# EAGLE design FMS (EAGLE 9.6.2)
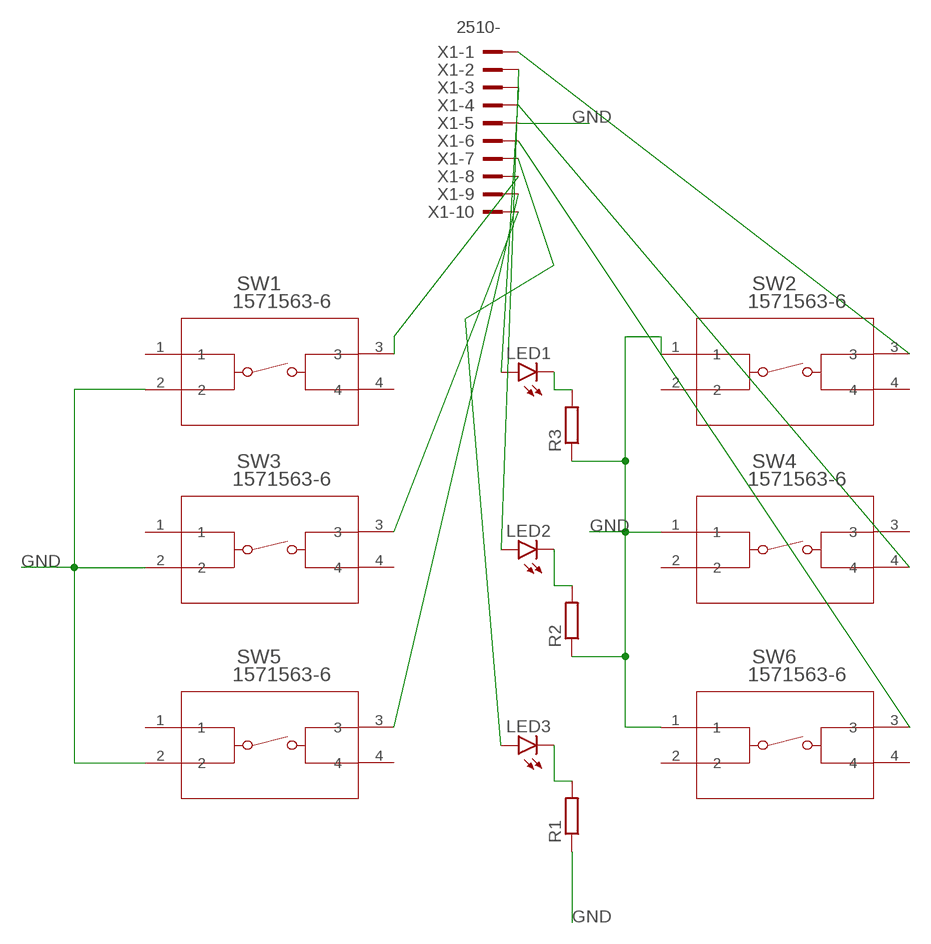
[diagram p0: schematic, sheet 1]

## Parts
LED1  LEDCHIPLED_1206  [CHIPLED_1206]
LED2  LEDCHIPLED_1206  [CHIPLED_1206]
LED3  LEDCHIPLED_1206  [CHIPLED_1206]
R1  R-EU_R1206  [R1206]
R2  R-EU_R1206  [R1206]
R3  R-EU_R1206  [R1206]
SW1  1571563-6  [SW4_1437565-E]
SW2  1571563-6  [SW4_1437565-E]
SW3  1571563-6  [SW4_1437565-E]
SW4  1571563-6  [SW4_1437565-E]
SW5  1571563-6  [SW4_1437565-E]
SW6  1571563-6  [SW4_1437565-E]
X1  2510-  [PAK100/2500-10]

## Nets
GND: R1.1 R2.1 R3.1 SW1.2 SW2.1 SW3.2 SW4.1 SW5.2 SW6.1 X1.5
N$1: LED1.A X1.3
N$2: SW2.3 X1.1
N$3: LED2.A X1.2
N$4: LED1.C R3.2
N$5: LED2.C R2.2
N$6: LED3.C R1.2
N$7: SW4.4 X1.4
N$8: SW6.3 X1.6
N$9: LED3.A X1.7
N$10: SW1.3 X1.8
N$11: SW3.3 X1.10
N$12: SW5.3 X1.9
Unconnected: SW1.1 SW1.4 SW2.2 SW2.4 SW3.1 SW3.4 SW4.2 SW4.3 SW5.1 SW5.4 SW6.2 SW6.4

## Library data of the parts
LED1-LED3 = led:LED: LED OSRAM: - CHIPLED LG R971, LG N971, LY N971, LG Q971, LY Q971, LO R971, LY R971 LH N974, LH R974 LS Q976, LO Q976, LY Q976 LO Q996 - Hyper CHIPLED LW Q18S LB Q993, LB Q99A, LB R99A - SideLED LS A670, LO A670, LY A670, LG A670, LP A670 LB A673, LV A673, LT A673, LW A673 LH A674 LY A675 LS A676, LA A676, LO A676, LY A676, LW A676 LS A679, LY A679, LG A679 - Hyper Micro SIDELED® LS Y876, LA Y876, LO Y876, LY Y876 LT Y87S - SmartLED LW L88C, LW L88S LB L89C, LB L89S, LG L890 LS L89K, LO L89K, LY L89K LS L896, LA L896, LO L896, LY L896 - TOPLED LS T670, LO T670, LY T670, LG T670, LP T670 LSG T670, LSP T670, LSY T670, LOP T670, LYG T670 LG T671, LOG T671, LSG T671 LB T673, LV T673, LT T673, LW T673 LH T674 LS T676, LA T676, LO T676, LY T676, LB T676, LH T676, LSB T676, LW T676 LB T67C, LV T67C, LT T67C, LS T67K, LO T67K, LY T67K, LW E67C LS E67B, LA E67B, LO E67B, LY E67B, LB E67C, LV E67C, LT E67C LW T67C LS T679, LY T679, LG T679 LS T770, LO T770, LY T770, LG T770, LP T770 LB T773, LV T773, LT T773, LW T773 LH T774 LS E675, LA E675, LY E675, LS T675 LS T776, LA T776, LO T776, LY T776, LB T776 LHGB T686 LT T68C, LB T68C - Hyper Mini TOPLED® LB M676 - Mini TOPLED Santana® LG M470 LS M47K, LO M47K, LY M47K Source: http://www.osram.convergy.de LUXEON: - LUMILED® LXK2-PW12-R00, LXK2-PW12-S00, LXK2-PW14-U00, LXK2-PW14-V00 LXK2-PM12-R00, LXK2-PM12-S00, LXK2-PM14-U00 LXK2-PE12-Q00, LXK2-PE12-R00, LXK2-PE12-S00, LXK2-PE14-T00, LXK2-PE14-U00 LXK2-PB12-K00, LXK2-PB12-L00, LXK2-PB12-M00, LXK2-PB14-N00, LXK2-PB14-P00, LXK2-PB14-Q00 LXK2-PR12-L00, LXK2-PR12-M00, LXK2-PR14-Q00, LXK2-PR14-R00 LXK2-PD12-Q00, LXK2-PD12-R00, LXK2-PD12-S00 LXK2-PH12-R00, LXK2-PH12-S00 LXK2-PL12-P00, LXK2-PL12-Q00, LXK2-PL12-R00 Source: www.luxeon.com KINGBRIGHT: KA-3528ASYC Source: www.kingbright.com
R1-R3 = rcl:R-EU_: RESISTOR, European symbol; SPICEPREFIX: R
SW1-SW6 = Switches:1571563-6; BUILT_BY: EMA_UL_Team; CATEGORY: Tactile Switches; COPYRIGHT: Copyright (C) 2016 Accelerated Designs. All rights reserved; DESCRIPTION: FSM14JSMAATR=TACT,SMT,T&R; MANUFACTURER_PART_NUMBER: 1571563-6; PART_STATUS: active; SERIES: Alcoswitch FSMJSMA; VENDOR: TE Connectivity
X1 = con-3m:2510-: 3M (TM) Pak 100 4-Wall Header Source: 3M; MF: 3M; MPN: 2510-6002UB; OC_FARNELL: 9838244; OC_NEWARK: 46F4725

## Board
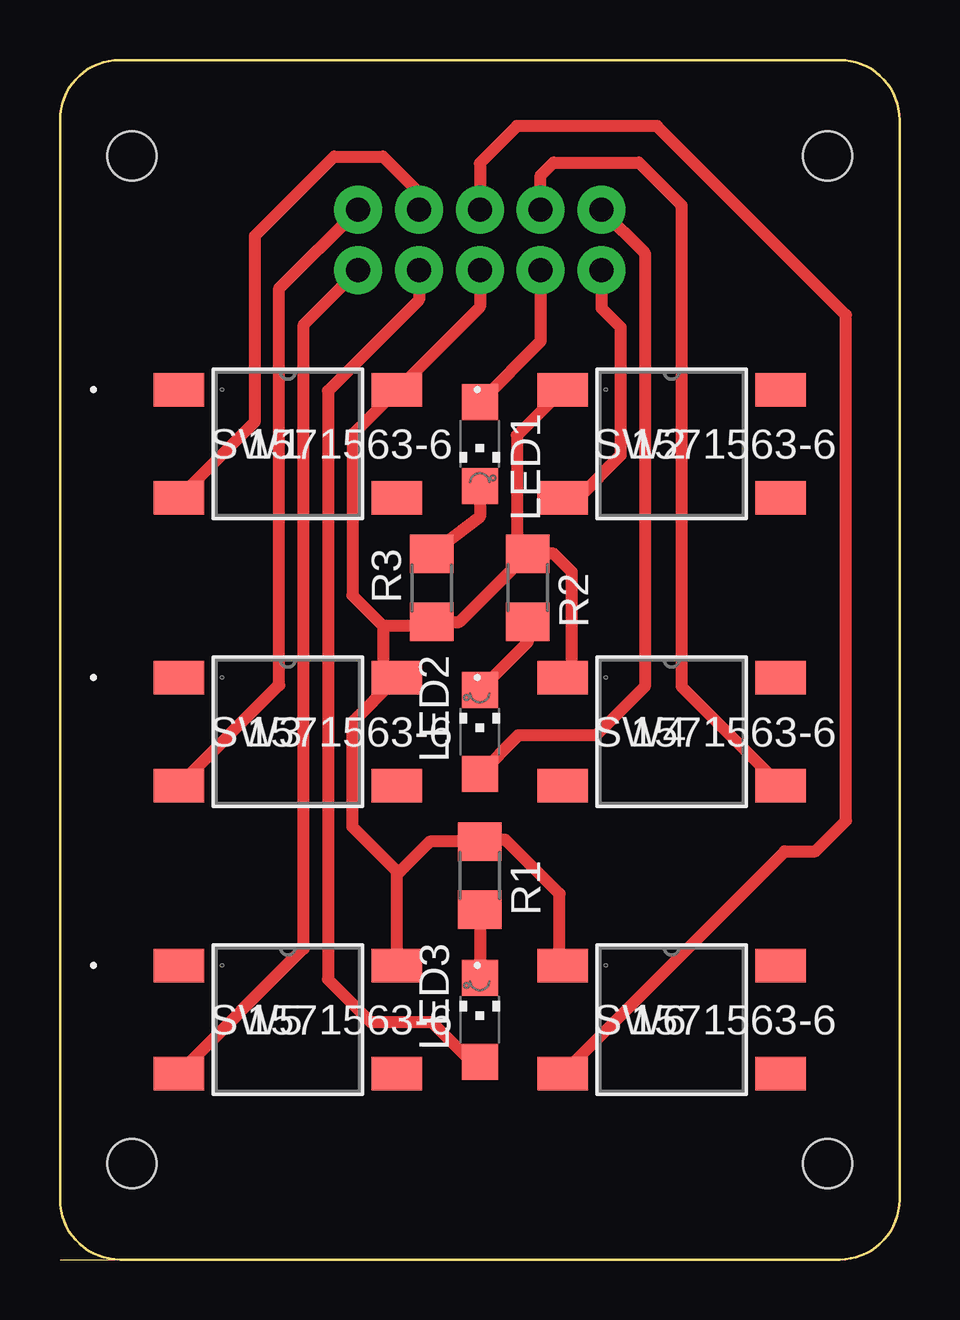
[diagram p1: board, top side]
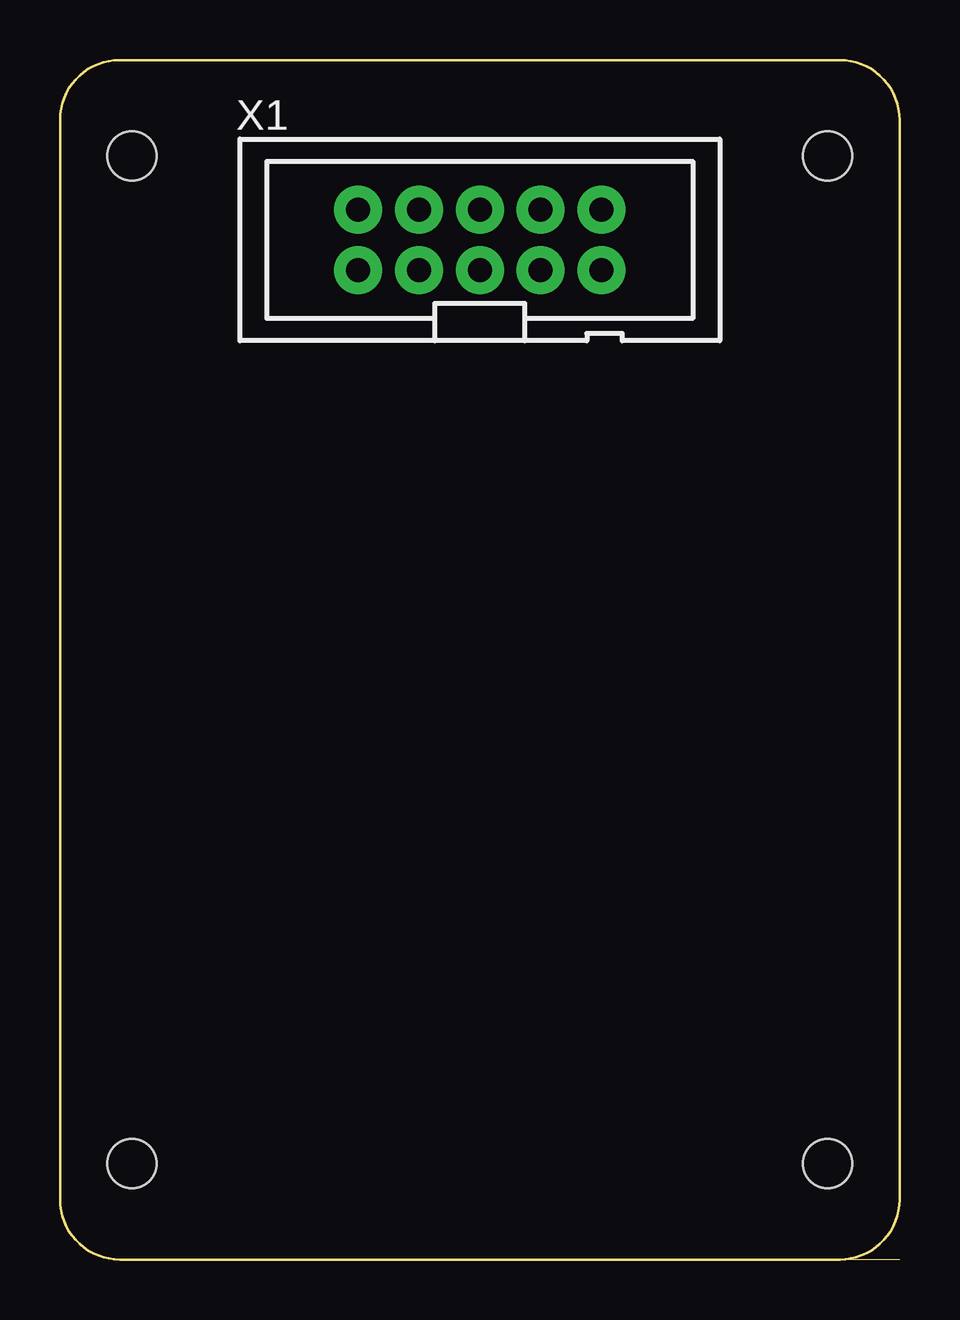
[diagram p2: board, bottom side, seen from below]

Size 35 x 50 mm. Coordinates in mm from the lower left corner, seen from the top.
Outline: 0,0 2.5,0
Outline: 2.5,0 arc-90 0,2.5 0,47.5 arc-90 2.5,50 32.5,50 arc-90 35,47.5 35,2.5 arc-90 32.5,0 2.5,0
Copper layers (1*16): Top 0.035mm / dielectric 1.5mm / Bottom 0.035mm
Design rules "swidzi_milling_3018_tht_test": minimum track width 20mil, minimum drill 0.8mm, track to track 20mil, track to pad 20mil, pad to pad 20mil, via to via 6mil, smd to smd 6mil, copper to edge 15mil, drill to drill 6mil, minimum pad ring 10mil, minimum via ring 8mil, stop-mask expansion 4mil, vias tented up to drill 0mil, thermal gap 10mil
Holes 2.05 mm at 3,4 32,4 3,46 32,46

### Footprints (pad centres in the part's own frame; a part is rotated, then mirrored left to right if it is on the bottom)
CHIPLED_1206 = smd 1.5 x 1.5: A 0,-1.75; C 0,1.75
R1206 = smd 1.6 x 1.803: 1 -1.422,0; 2 1.422,0
SW4_1437565-E = smd 2.108 x 1.397: 1 -4.55,2.25; 2 4.55,2.25; 3 -4.55,-2.25; 4 4.55,-2.25
PAK100/2500-10 = drill 1 pad 1.422: 1 -5.08,-1.27; 2 -5.08,1.27; 3 -2.54,-1.27; 4 -2.54,1.27; 5 0,-1.27; 6 0,1.27; 7 2.54,-1.27; 8 2.54,1.27; 9 5.08,-1.27; 10 5.08,1.27

### Placement (x,y rotation side)
LED1  17.5,34 180 top
LED2  17.5,22 0 top
LED3  17.5,10 0 top
R1  17.5,16 270 top
R2  19.5,28 270 top
R3  15.5,28 90 top
SW1  9.5,34 0 top
SW2  25.5,34 0 top
SW3  9.5,22 0 top
SW4  25.5,22 0 top
SW5  9.5,10 0 top
SW6  25.5,10 0 top
X1  17.5,42.5 0 bottom

### Tracks (layer width: path | path; a pad name or v marks a point on that pad's centre or on a via)
GND
  Top 0.508: X1.5 17.5,39.7 SW1.2 12.19,34.39 12.19,27.69 13.46,26.42 | SW5.2 14.05,16.18 | 14.05,16.18 12.19,18.03 12.19,22.39 13.95,24.15 | 13.95,24.15 SW3.2 | SW6.1 20.83,12.37 20.83,15.24 18.57,17.5 17.58,17.5 R1.1 15.42,17.42 14.18,16.18 14.05,16.18 | SW4.1 21.34,24.64 21.34,28.66 20.58,29.42 R2.1 | 20.08,28.95 R2.1 | R2.1 19.05,28.95 19.05,34.35 SW2.1 | 13.95,24.15 13.46,24.64 13.46,26.42 | 13.46,26.42 15.34,26.42 R3.1 16.66,26.58 R2.1
N$1
  Top 0.508: X1.3 20.04,38.29 LED1.A
N$2
  Top 0.508: X1.1 22.58,39.65 23.37,38.86 23.37,33.53 21.59,31.75 SW2.3
N$3
  Top 0.508: X1.2 24.38,41.97 24.38,23.88 22.35,21.84 19.09,21.84 LED2.A
N$4
  Top 0.508: LED1.C 17.5,30.95 R3.2
N$5
  Top 0.508: R2.2 19.5,25.75 LED2.C
N$6
  Top 0.508: R1.2 LED3.C
N$7
  Top 0.508: X1.4 20.04,45.19 20.57,45.72 24.13,45.72 25.91,43.94 25.91,23.89 SW4.4
N$8
  Top 0.508: SW6.3 30.22,17.02 31.5,17.02 32.77,18.29 32.77,39.37 24.89,47.24 19.05,47.24 17.5,45.69 X1.6
N$9
  Top 0.508: X1.7 14.96,39.99 11.18,36.21 11.18,11.68 12.95,9.91 15.49,9.91 17.15,8.25 LED3.A
N$10
  Top 0.508: SW1.3 8.13,34.93 8.13,42.67 11.43,45.97 13.46,45.97 14.96,44.48 X1.8
N$11
  Top 0.508: SW3.3 9.14,23.94 9.14,40.49 X1.10
N$12
  Top 0.508: SW5.3 10.16,12.96 10.16,38.97 X1.9